# EAGLE design KNXTransceiverBoard_Aufsteck_V1 (EAGLE 6.1)
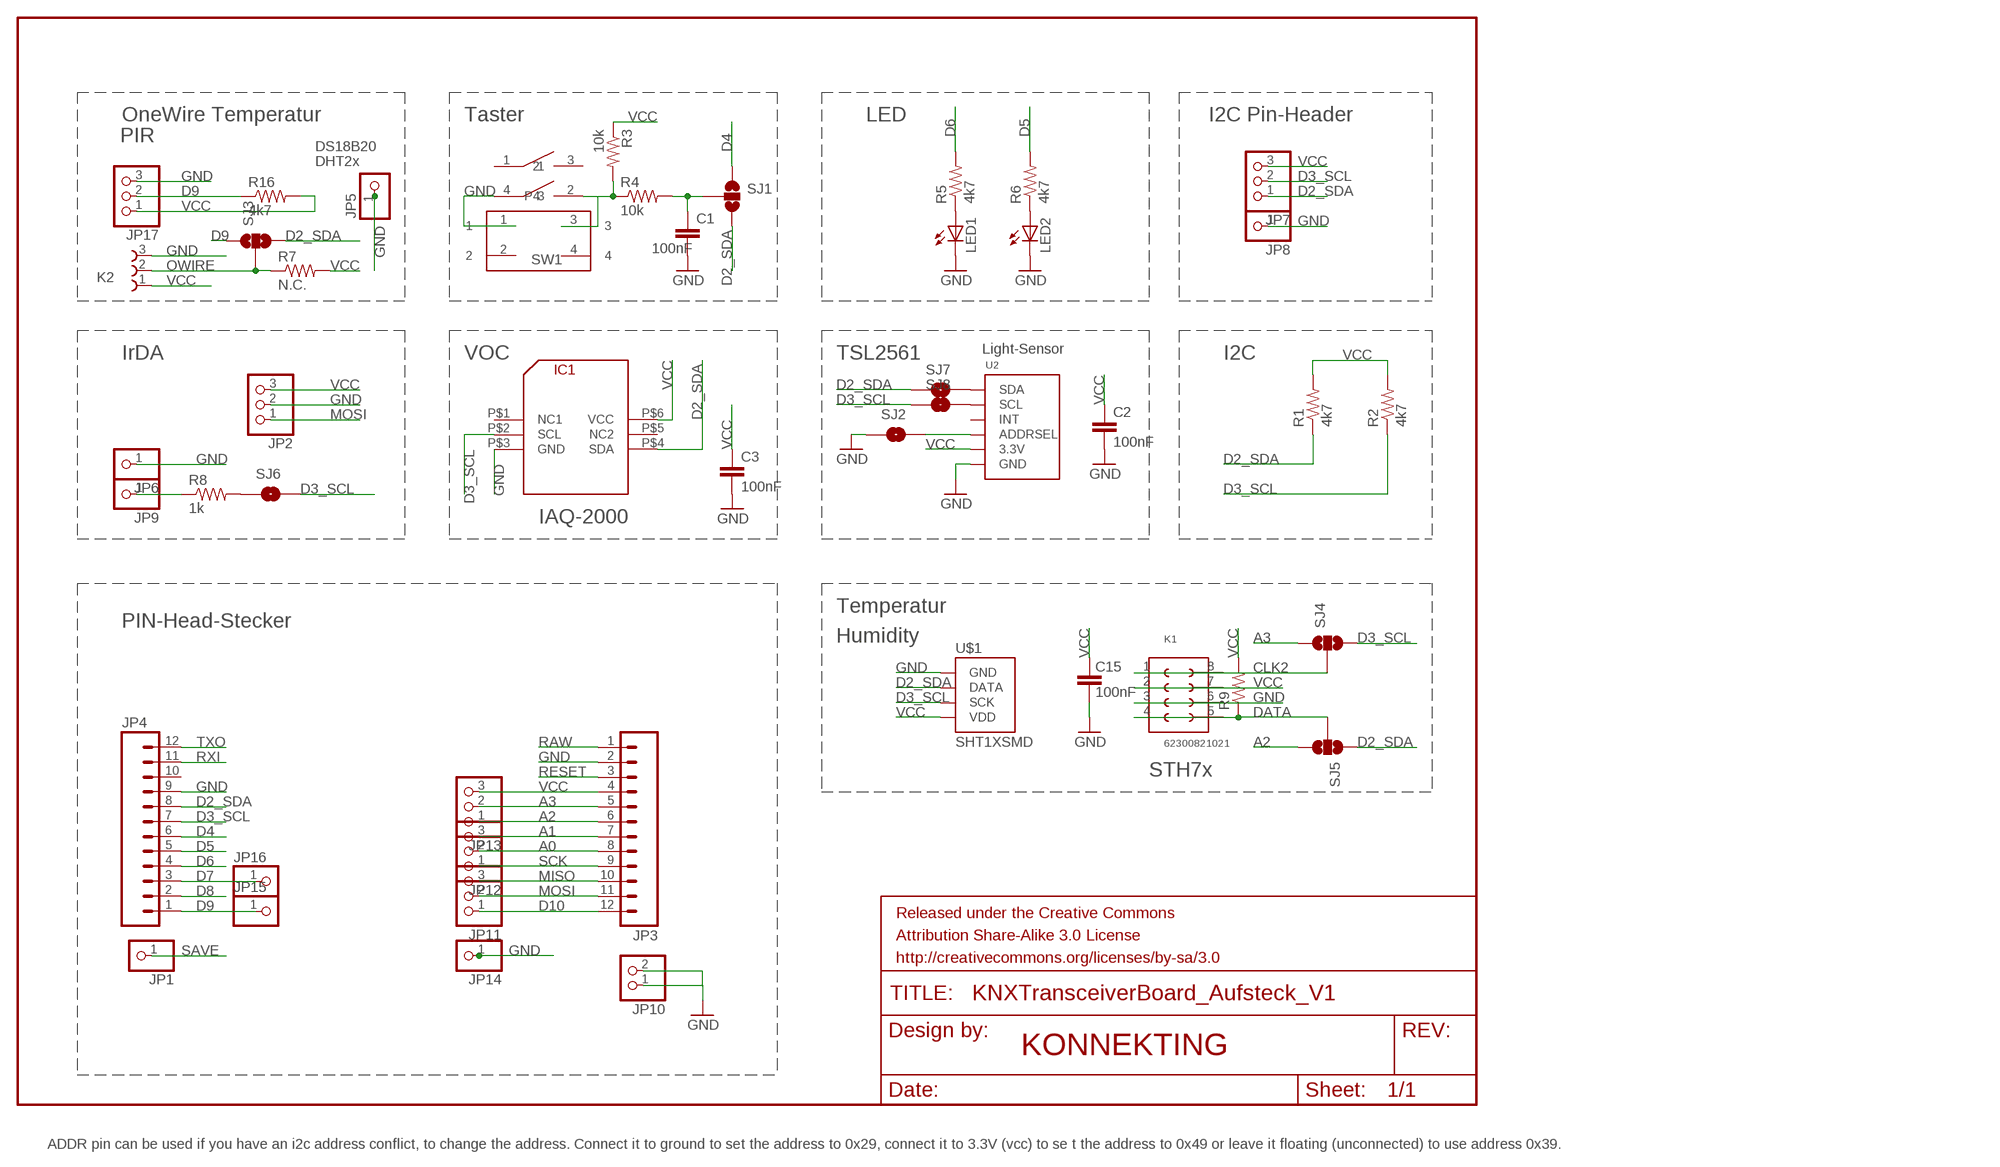
[diagram p0: schematic, sheet 1]

## Parts
C1  100nF  C-EUC0603  [C0603]
C2  100nF  C-EUC0603  [C0603]
C3  100nF  C-EUC0603  [C0603]
C15  100nF  CAP0603-CAP  [0603-CAP]
FRAME1  FRAME-LETTER  [CREATIVE_COMMONS]
IC1  AMSVOC  [AMSVOC]
JP1  PINHD-1X1  [1X01]
JP2  PINHD-1X3  [1X03]
JP3  M12PTH  [1X12]
JP4  M12PTH  [1X12]
JP5  PINHD-1X1  [1X01]
JP6  PINHD-1X1  [1X01]
JP7  PINHD-1X3  [1X03]
JP8  PINHD-1X1  [1X01]
JP9  PINHD-1X1  [1X01]
JP10  PINHD-1X2  [1X02]
JP11  PINHD-1X3  [1X03]
JP12  PINHD-1X3  [1X03]
JP13  PINHD-1X3  [1X03]
JP14  PINHD-1X1  [1X01]
JP15  PINHD-1X1  [1X01]
JP16  PINHD-1X1  [1X01]
JP17  PINHD-1X3  [1X03]
K1  62300821021  [62300821021]
K2  691101710003  [691101710003]
LED1  LEDCHIPLED_0805  [CHIPLED_0805]
LED2  LEDCHIPLED_0805  [CHIPLED_0805]
R1  4k7  RESISTOR0603-RES  [0603-RES]
R2  4k7  RESISTOR0603-RES  [0603-RES]
R3  10k  RESISTOR0603-RES  [0603-RES]
R4  10k  RESISTOR0603-RES  [0603-RES]
R5  4k7  RESISTOR0603-RES  [0603-RES]
R6  4k7  RESISTOR0603-RES  [0603-RES]
R7  N.C.  RESISTOR0603-RES  [0603-RES]
R8  1k  RESISTOR0603-RES  [0603-RES]
R9  RESISTOR0603-RES  [0603-RES]
R16  4k7  RESISTOR0603-RES  [0603-RES]
SJ1  SOLDERJUMPER_2WAY-OLDS  [SJ_3]
SJ2  SOLDERJUMPERNO  [SJ_2S-NO]
SJ3  SOLDERJUMPER_2WAY-OLDS  [SJ_3]
SJ4  SOLDERJUMPER_2WAY-OLDS  [SJ_3]
SJ5  SOLDERJUMPER_2WAY-OLDS  [SJ_3]
SJ6  SOLDERJUMPERNO  [SJ_2S-NO]
SJ7  SOLDERJUMPERNO  [SJ_2S-NO]
SJ8  SOLDERJUMPERNO  [SJ_2S-NO]
SW1  430156095926  [430156095926]
U2  TSL2561  [TSL2561_FN]
U$1  SHT1XSMD  [SHT1X]
U$2  TASTER  [TASTER]

## Nets
A0: JP3.8 JP12.2
A1: JP3.7 JP12.3
A2: JP3.6 JP13.1 SJ5.3
A3: JP3.5 JP13.2 SJ4.1
CLK2: K1.1 K1.8 SJ4.2
D2_SDA: IC1.P$4(SDA) JP4.8 JP7.1 R1.1 SJ1.3 SJ3.3 SJ5.1 SJ7.1 U$1.2(DATA)
D3_SCL: IC1.P$2(SCL) JP4.7 JP7.2 R2.1 SJ4.3 SJ6.2 SJ8.1 U$1.3(SCK)
D4: JP4.6 SJ1.1
D5: JP4.5 R6.2
D6: JP4.4 R5.2
D7: JP4.3 JP16.1
D8: JP4.2
D9: JP4.1 JP15.1 JP17.2 R16.1 SJ3.1
D10: JP3.12 JP11.1
DATA: K1.4 K1.5 R9.1 SJ5.2
GND [vcc]: C1.2 C2.2 C3.2 C15.1 IC1.P$3(GND) JP2.2 JP3.2 JP4.9 JP5.1 JP6.1 JP8.1 JP10.1 JP10.2 JP14.1 JP17.3 K1.3 K1.6 K2.3 LED1.C LED2.C SJ2.1 SW1.1 U2.VSS(GND) U$1.1(GND) U$2.4
MISO: JP3.10 JP11.3
MOSI: JP2.1 JP3.11 JP11.2
N$1: R3.2 R4.1 SW1.3 U$2.2(P4)
N$2: C1.1 R4.2 SJ1.2
N$3: LED1.A R5.1
N$4: LED2.A R6.1
N$5: JP9.1 R8.1
N$6: R8.2 SJ6.1
N$7: SJ7.2 U2.DATA(SDA)
N$8: SJ8.2 U2.CLK(SCL)
N$10: SJ2.2 U2.ADR(ADDRSEL)
OWIRE: K2.2 R7.1 SJ3.2
RAW [vcc]: JP3.1
RESET: JP3.3
RXI: JP4.11
SAVE: JP1.1
SCK: JP3.9 JP12.1
TXO: JP4.12
VCC: C2.1 C3.1 C15.2 IC1.P$6(VCC) JP2.3 JP3.4 JP7.3 JP13.3 JP17.1 K1.2 K1.7 K2.1 R1.2 R2.2 R3.1 R7.2 R9.2 R16.2 U2.VDD(3.3V) U$1.4(VDD)
Unconnected: IC1.P$1(NC1) IC1.P$5(NC2) JP4.10 SW1.2 SW1.4 U2.INT U$2.1 U$2.3

## Notes on the sheet
- OneWire Temperatur | Taster | LED | I2C Pin-Header
- PIR
- DS18B20
- DHT2x
- Light-Sensor
- IrDA | VOC | TSL2561 | I2C
- IAQ-2000
- Temperatur
- PIN-Head-Stecker
- Humidity
- STH7x
- KONNEKTING
- ADDR pin can be used if you have an i2c address conflict, to change the address. Connect it to ground to set the address to 0x29, connect it to 3.3V (vcc) to se t the address to 0x49 or leave it floating (unconnected) to use address 0x39.

## Library data of the parts
C1-C3 = rcl:C-EU: CAPACITOR, European symbol
C15 = SparkFun:CAP: Capacitor Standard 0603 ceramic capacitor, and 0.1" leaded capacitor.
FRAME1 = SparkFun-Aesthetics:FRAME-LETTER: Schematic Frame Standard 8.5x11 US Letter frame
IC1 = AMSVOC:AMSVOC
JP1 JP5 JP14-JP16 = pinhead:PINHD-1X1: PIN HEADER
JP2 JP7 JP11-JP13 JP17 = adafruit:PINHD-1X3: PIN HEADER
JP3 JP4 = SparkFun:M12: Header 12 Standard 12-pin 0.1" header. Use with straight break away headers (SKU : PRT-00116), right angle break away headers (PRT-00553), swiss pins (PRT-00743), machine pins (PRT-00117), and female headers (PRT-00115).
JP6 JP8 JP9 = adafruit:PINHD-1X1: Pin header 1x1 for 0.1" spacing With round pins
JP10 = pinhead:PINHD-1X2: PIN HEADER
K1 = Wuerth_Elektronik_eiCan_01_Pin__Socked_Headers_v1_3:62300821021: WR-PHD 1.27mm Dual SMT Socket Header H=4.50mm, 8 Pins
K2 = Wuerth_Elektronik_TerminalBlocks:691101710003: WR-TBL Serie 101 - 5.0mm HOrizontal Entry Modular with Pressure Clamp - 2.5mm2 Wires , 3 pins=>Code : Con-TBL_Screw_PressureClamp_691101710003 <http://katalog.we-online.de/media/images/eican/Con-TBL_Screw_PressureClamp_6911017100xx_pf2.jpg> Details see: http://katalog.we-online.de/en/em/691_101_710_0xx Created 2014-06-17, Karrer Zheng 2014 (C) Würth Elektronik
LED1 LED2 = led:LED: LED OSRAM: - CHIPLED LG R971, LG N971, LY N971, LG Q971, LY Q971, LO R971, LY R971 LH N974, LH R974 LS Q976, LO Q976, LY Q976 LO Q996 - Hyper CHIPLED LW Q18S LB Q993, LB Q99A, LB R99A - SideLED LS A670, LO A670, LY A670, LG A670, LP A670 LB A673, LV A673, LT A673, LW A673 LH A674 LY A675 LS A676, LA A676, LO A676, LY A676, LW A676 LS A679, LY A679, LG A679 - Hyper Micro SIDELED® LS Y876, LA Y876, LO Y876, LY Y876 LT Y87S - SmartLED LW L88C, LW L88S LB L89C, LB L89S, LG L890 LS L89K, LO L89K, LY L89K LS L896, LA L896, LO L896, LY L896 - TOPLED LS T670, LO T670, LY T670, LG T670, LP T670 LSG T670, LSP T670, LSY T670, LOP T670, LYG T670 LG T671, LOG T671, LSG T671 LB T673, LV T673, LT T673, LW T673 LH T674 LS T676, LA T676, LO T676, LY T676, LB T676, LH T676, LSB T676, LW T676 LB T67C, LV T67C, LT T67C, LS T67K, LO T67K, LY T67K, LW E67C LS E67B, LA E67B, LO E67B, LY E67B, LB E67C, LV E67C, LT E67C LW T67C LS T679, LY T679, LG T679 LS T770, LO T770, LY T770, LG T770, LP T770 LB T773, LV T773, LT T773, LW T773 LH T774 LS E675, LA E675, LY E675, LS T675 LS T776, LA T776, LO T776, LY T776, LB T776 LHGB T686 LT T68C, LB T68C - Hyper Mini TOPLED® LB M676 - Mini TOPLED Santana® LG M470 LS M47K, LO M47K, LY M47K Source: http://www.osram.convergy.de LUXEON: - LUMILED® LXK2-PW12-R00, LXK2-PW12-S00, LXK2-PW14-U00, LXK2-PW14-V00 LXK2-PM12-R00, LXK2-PM12-S00, LXK2-PM14-U00 LXK2-PE12-Q00, LXK2-PE12-R00, LXK2-PE12-S00, LXK2-PE14-T00, LXK2-PE14-U00 LXK2-PB12-K00, LXK2-PB12-L00, LXK2-PB12-M00, LXK2-PB14-N00, LXK2-PB14-P00, LXK2-PB14-Q00 LXK2-PR12-L00, LXK2-PR12-M00, LXK2-PR14-Q00, LXK2-PR14-R00 LXK2-PD12-Q00, LXK2-PD12-R00, LXK2-PD12-S00 LXK2-PH12-R00, LXK2-PH12-S00 LXK2-PL12-P00, LXK2-PL12-Q00, LXK2-PL12-R00 Source: www.luxeon.com KINGBRIGHT: KA-3528ASYC Source: www.kingbright.com
R1-R9 R16 = SparkFun:RESISTOR: Resistor Basic schematic elements and footprints for 0603, 1206, and PTH resistors.
SJ1 SJ3-SJ5 = SparkFun:SOLDERJUMPER_2WAY-OLD: Solder Jumper 2 way solder jumper
SJ2 SJ6-SJ8 = SparkFun:SOLDERJUMPER: Solder Jumper Standard SMD solder jumper. Used to automate production. Two varients : Normally Open and Normally Closed are the same, but have different paste layers. NC will have a large amount of paste and should jumper during reflow.
SW1 = Wuerth_Kurzhubtaster:430156095926: WS-TST-6x6 mm THT Tact Switch,4 pins
U2 = microbuilder:TSL2561: TSL2561 Light-To-Digital Sensor Mouser Part Numbers: CS (obsolete): 856-TSL2561CS DFN (cheapest): 856-TSL2561FN
U$1 = SparkFun:SHT1X: SHT1x Humdity Sensor Sensirion humdity sensor. Schematic element and footprint proven. Spark Fun Electronics SKU : COM-08227
U$2 = Matthias_1:TASTER

## Net classes
0 default: width 0.203 mm
1 vcc: width 0.254 mm

## Board
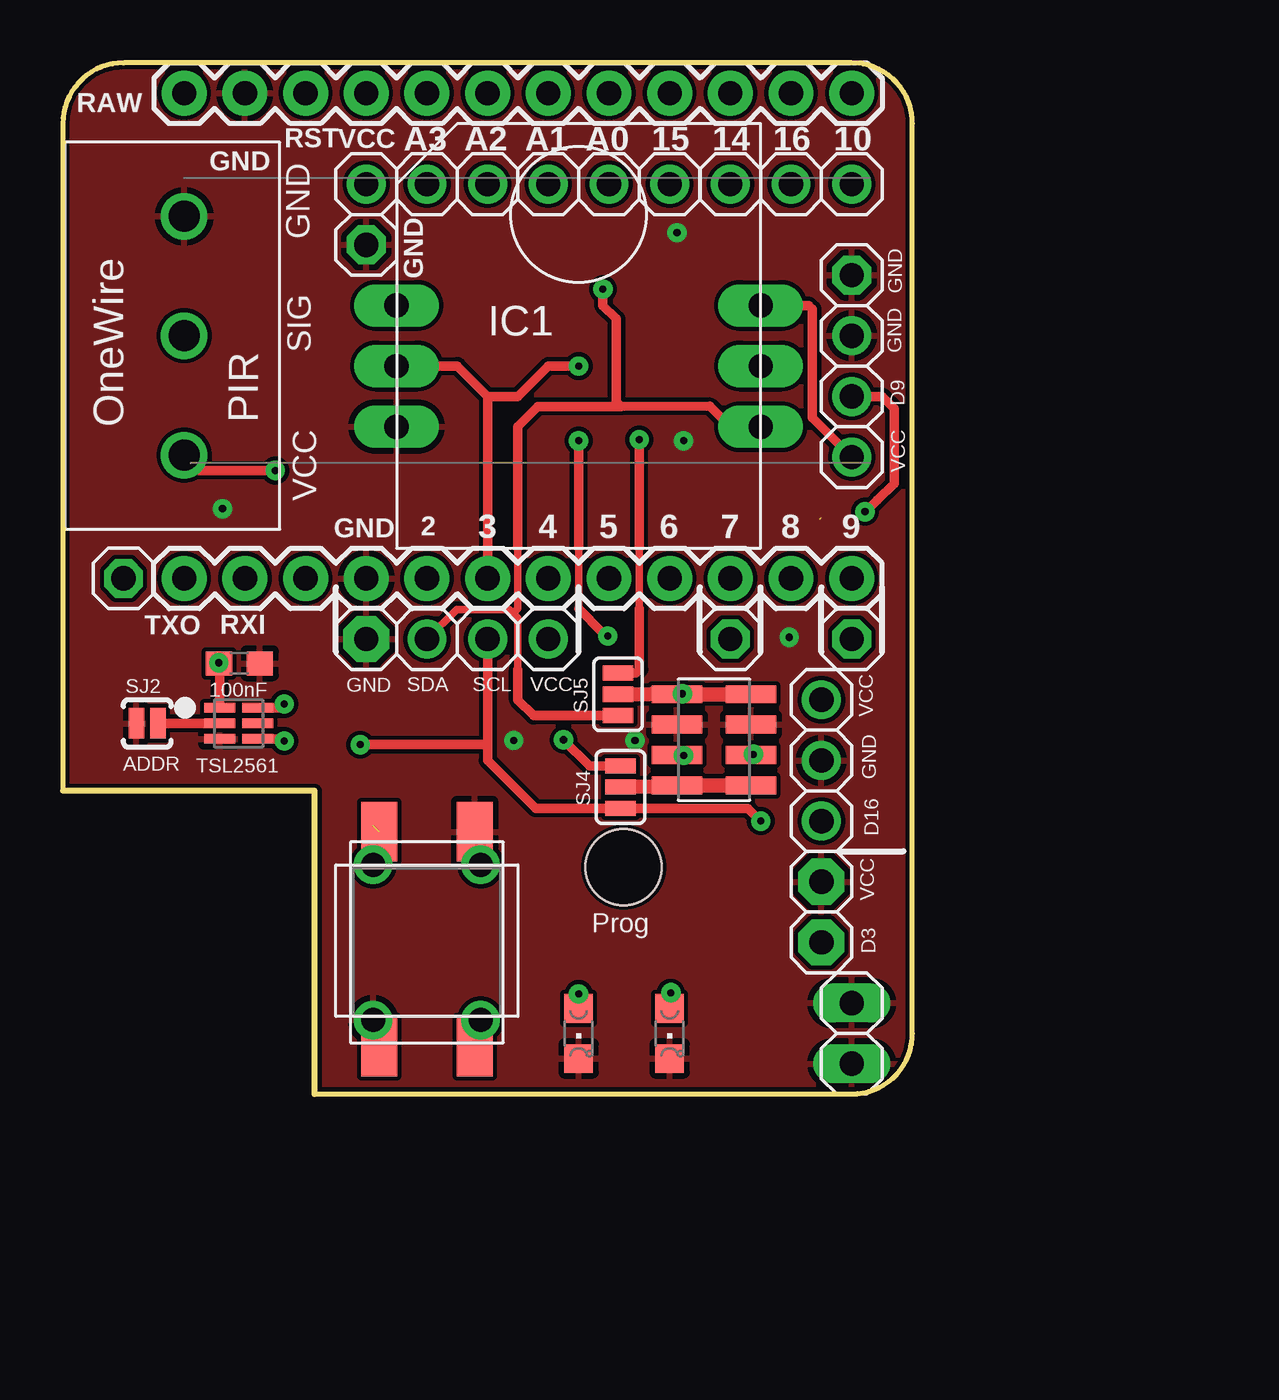
[diagram p1: board, top side]
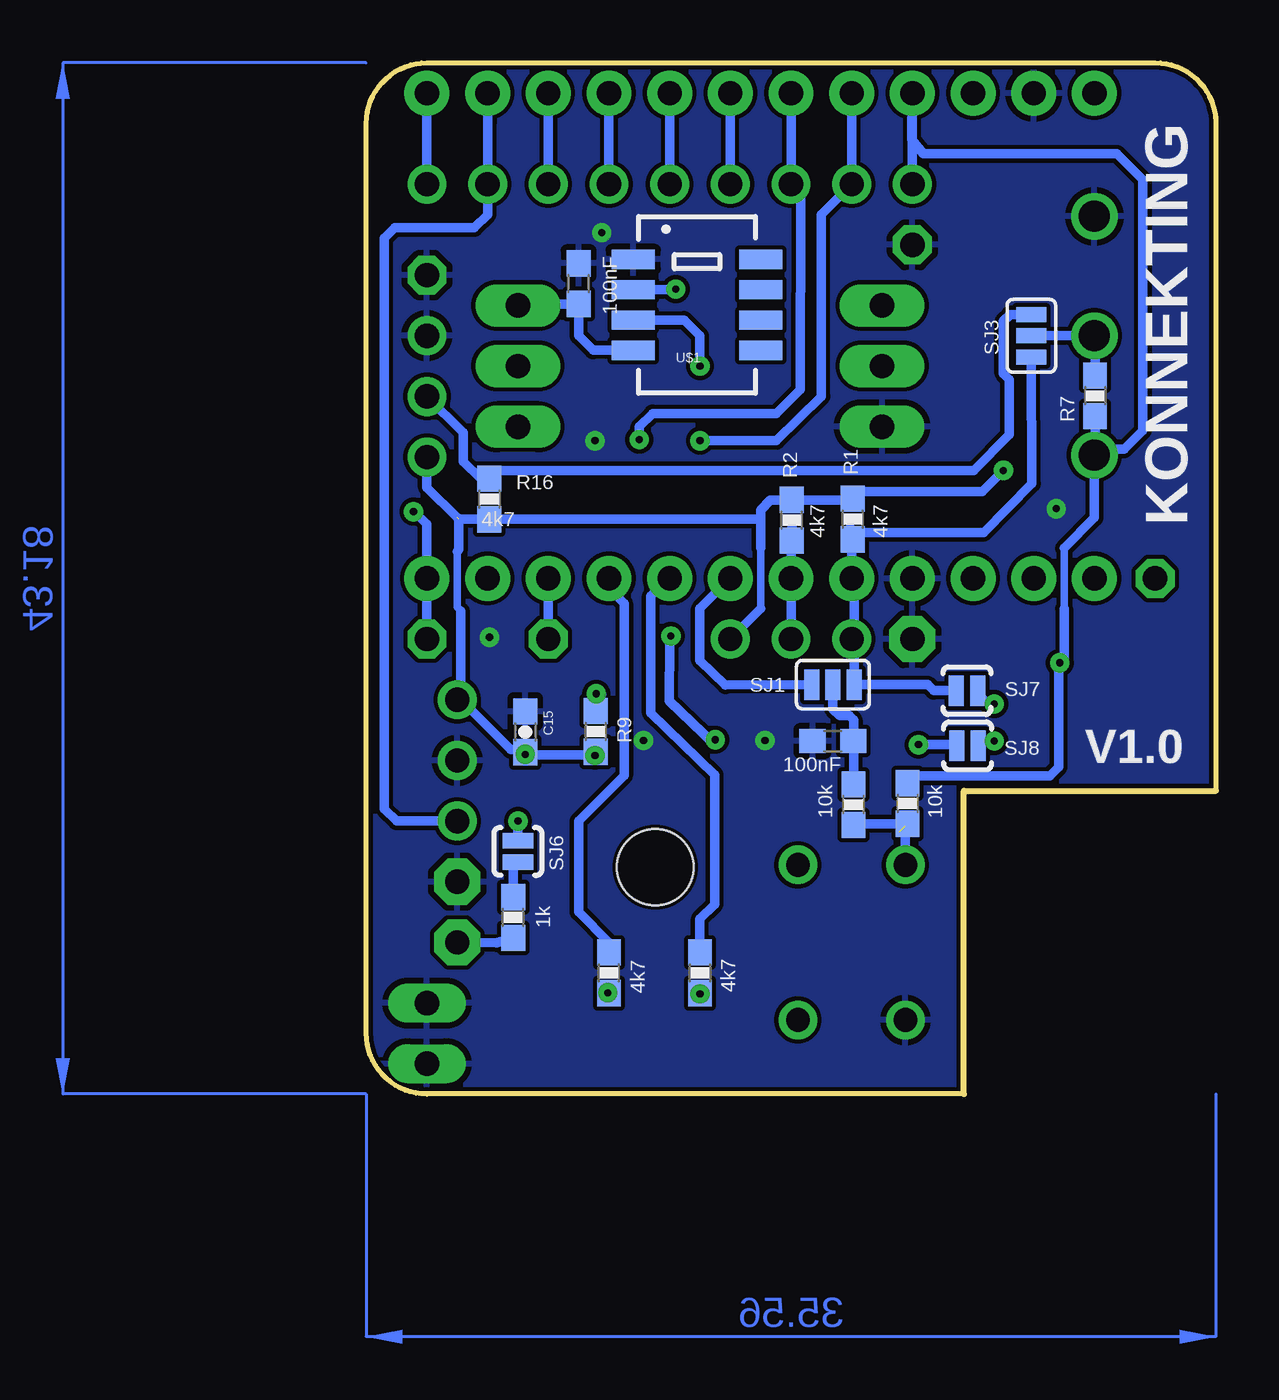
[diagram p2: board, bottom side, seen from below]

Size 35.56 x 43.18 mm. Coordinates in mm from the lower left corner, seen from the top.
Outline: 10.54,0 33.02,0 arc90 35.56,2.54 35.56,40.64 arc90 33.02,43.18 2.54,43.18 arc90 0,40.64 0,12.7 10.54,12.7 10.54,0
Copper layers (1*16): Top 0.035mm / dielectric 1.5mm / Bottom 0.035mm
Design rules: minimum track width 8mil, minimum drill 15mil, track to track 7mil, track to pad 7mil, pad to pad 7mil, via to via 7mil, smd to smd 7mil, copper to edge 7mil, drill to drill 7mil, minimum pad ring 12mil, minimum via ring 10mil, stop-mask expansion 4mil, vias tented up to drill 20mil, thermal gap 10mil
Holes 3.2 mm at 23.47,9.5
tRestrict: area -21.3,-1.8 to -21.1,-1.7; area -17.4,2.2 to -17.3,2.2; area -25,-1.2 to -17.9,6.1

### Footprints (pad centres in the part's own frame; a part is rotated, then mirrored left to right if it is on the bottom)
C0603 = smd 1.1 x 1: 1 -0.85,0; 2 0.85,0
0603-CAP = smd 1.1 x 1: 1 -0.85,0; 2 0.85,0
AMSVOC = drill 1.016 pad 1.778 long: P$1 0,10.16; P$2 0,7.62; P$3 0,5.08; P$4 15.24,5.08; P$5 15.24,7.62; P$6 15.24,10.16
1X01 = drill 1.016 octagon: 1 0,0
1X03 = drill 1.016: 1 -2.54,0; 2 0,0; 3 2.54,0
1X12 = drill 1.016 pad 1.88: 1 0,0; 2 2.54,0; 3 5.08,0; 4 7.62,0; 5 10.16,0; 6 12.7,0; 7 15.24,0; 8 17.78,0; 9 20.32,0; 10 22.86,0; 11 25.4,0; 12 27.94,0
1X01' = drill 1.016 pad 1.93 octagon: 1 0,0
1X02 = drill 1.016 long: 1 -1.27,0; 2 1.27,0
62300821021 = smd 0.75 x 2.1: 1 -1.905,1.55; 2 -0.635,1.55; 3 0.635,1.55; 4 1.905,1.55; 5 1.905,-1.55; 6 0.635,-1.55; 7 -0.635,-1.55; 8 -1.905,-1.55
691101710003 = drill 1.3: 1 -5,0; 2 0,0; 3 5,0
CHIPLED_0805 = smd 1.2 x 1.2: A 0,-1.05; C 0,1.05
0603-RES = smd 1.1 x 1: 1 -0.85,0; 2 0.85,0
SJ_3 = smd 0.635 x 1.27: 1 -0.889,0; 2 0,0; 3 0.889,0
SJ_2S-NO = smd 0.635 x 1.27: 1 -0.45,0; 2 0.45,0
430156095926 = drill 1: 1 -3.25,2.25; 2 -3.25,-2.25; 3 3.25,2.25; 4 3.25,-2.25
TSL2561_FN = smd 1.3 x 0.4: ADR -0.8,0; CLK 0.8,-0.65; DATA 0.8,0.65; INT 0.8,0; VDD -0.8,0.65; VSS -0.8,-0.65
SHT1X = smd 1.8 x 0.8: 1 -2.667,1.905; 2 -2.667,0.635; 3 -2.667,-0.635; 4 -2.667,-1.905; 5 2.667,-1.905; 6 2.667,-0.635; 7 2.667,0.635; 8 2.667,1.905
TASTER = smd 1.5 x 2.5: 1 -2,0; 2 -2,9; 3 2,0; 4 2,9

### Placement (x,y rotation side)
C1  16.03,14.78 180 bottom
C2  7.39,18.03 0 top
C3  26.67,33.93 90 bottom
C15  28.91,15.16 270 bottom
FRAME1  29.79,16.63 90 top
IC1  13.97,22.86 0 top
JP1  2.54,21.59 0 top
JP2  31.75,13.97 90 top
JP3  5.08,41.91 0 top
JP4  33.02,21.59 180 top
JP5  33.02,34.29 0 top
JP6  [1X01']  31.75,8.89 0 top
JP7  17.78,19.05 0 top
JP8  [1X01']  12.7,19.05 0 top
JP9  [1X01']  31.75,6.35 0 top
JP10  33.02,2.54 90 top
JP11  30.48,38.1 180 top
JP12  22.86,38.1 180 top
JP13  15.24,38.1 180 top
JP14  12.7,35.56 0 top
JP15  33.02,19.05 0 top
JP16  27.94,19.05 0 top
JP17  33.02,29.21 90 top
K1  27.25,14.83 90 top
K2  5.08,31.75 90 top
LED1  25.4,2.54 180 top
LED2  21.59,2.54 180 top
R1  15.19,24.08 90 bottom
R2  17.75,24.03 90 bottom
R3  12.9,12.17 270 bottom
R4  15.16,12.12 90 bottom
R5  25.4,5.08 90 bottom
R6  21.59,5.08 90 bottom
R7  5.05,29.24 270 bottom
R8  29.41,7.39 90 bottom
R9  25.96,15.19 270 bottom
R16  30.4,24.92 270 bottom
SJ1  16.03,17.14 0 bottom
SJ2  3.53,15.52 0 top
SJ3  7.72,31.75 270 bottom
SJ4  23.34,12.85 270 top
SJ5  23.24,16.74 90 top
SJ6  29.21,10.16 90 bottom
SJ7  10.41,16.89 0 bottom
SJ8  10.39,14.58 0 bottom
SW1  15.24,6.35 90 top
U2  7.37,15.52 0 top
U$1  21.72,33.05 0 bottom
U$2  15.24,1.98 0 top

### Tracks (layer width: path | path; a pad name or v marks a point on that pad's centre or on a via)
A0
  Bottom 0.406: JP3.8 JP12.2
A1
  Bottom 0.406: JP12.3 JP3.7
A2  (via drill 0.3)
  Top 0.305: 24.13,20.32 24.13,22.86
  Top 0.406: SJ5.3 23.98,17.63 24.13,17.78 24.13,20.32 | 24.13,22.86 v24.13,27.41
  Bottom 0.406: JP3.6 JP13.1 17.78,38.05 17.37,37.64 17.4,29.49 18.39,28.5 23.57,28.5 24.13,27.94 v24.13,27.41
A3  (via drill 0.3)
  Top 0.305: 21.59,20.32 21.59,22.86
  Top 0.406: SJ4.1 22.05,13.74 v20.96,14.83 | v22.81,19.18 22.58,19.33 21.59,20.32 | 21.59,22.86 v21.59,27.36
  Bottom 0.406: JP3.5 JP13.2 16.51,36.83 16.51,29.21 18.39,27.36 v21.59,27.36 | v20.96,14.83 20.98,14.63 22.89,16.46 22.86,18.92 v22.81,19.18
CLK2
  Top 0.61: K1.8 25.73,12.93 | 25.73,12.93 25.68,12.88 25.65,12.88 | SJ4.2 25.65,12.88 | 25.65,12.88 25.68,12.9 | 25.73,12.93 K1.1
D2_SDA  (via drill 0.3)
  Top 0.305: 19.05,17.78 19.05,19.94 18.86,20.13 | 18.86,20.13 18.69,20.3 16.49,20.3 JP7.1 | 19.05,22.86 19.05,20.32 18.86,20.13
  Top 0.406: SJ5.1 19.71,15.85 19.05,16.51 19.05,17.78 | IC1.P$4 27.94,27.94 27.08,28.8 23.37,28.79 | 23.37,28.79 19.89,28.78 19.05,27.94 19.05,22.86 | v22.61,33.71 22.61,33.02 23.17,32.46 23.17,28.99 23.37,28.79
  Bottom 0.406: SJ1.3 15.14,21.49 JP4.8 15.24,23.57 | 15.24,23.57 R1.1 | R1.1 15.04,23.47 15,23.51 9.71,23.51 7.7,25.55 SJ3.3 | SJ1.3 15.14,18.95 JP7.1 | 15.29,23.62 15.29,23.7 15.26,23.49 | 15.26,23.49 15.29,23.72 15.24,23.57 | R1.1 15.26,23.49 | SJ1.3 12.07,17.14 11.81,16.89 SJ7.1 | U$1.2 22.63,33.68 v22.61,33.71
D3_SCL  (via drill 0.3)
  Top 0.406: v29.21,11.43 28.68,11.96 SJ4.3 19.79,11.96 17.78,13.97 17.78,14.5 | JP7.2 17.78,14.5 | v12.45,14.63 17.65,14.63 17.78,14.5 | IC1.P$2 16.51,30.48 17.78,29.21 | 17.78,29.21 JP4.7 | v21.59,30.48 20.32,30.48 19.05,29.21 17.78,29.21
  Bottom 0.406: 17.78,23.49 JP4.7 JP7.2 | 17.73,23.72 17.75,23.65 17.78,23.49 | R2.1 17.78,23.49 | v29.21,11.43 SJ6.2 29.21,10.59 | v12.45,14.63 10.92,14.63 10.87,14.58 SJ8.1 | U$1.3 22.25,32.41 21.59,31.75 v21.59,30.48
D4
  Bottom 0.406: SJ1.1 20.52,17.12 21.59,18.16 21.59,20.32 JP4.6
D5
  Bottom 0.406: R6.2 21.59,7.34 20.98,7.95 20.98,13.36 23.65,15.95 23.65,20.85 22.94,21.59 JP4.5
D6
  Bottom 0.406: R5.2 25.4,6.35 26.67,7.62 26.67,11.43 24.76,13.34 24.76,20.55 25.4,21.18 JP4.4
D7
  Bottom 0.406: JP4.3 JP16.1
D9  (via drill 0.3)
  Top 0.406: v33.58,24.38 34.09,24.87 34.8,25.55 34.8,28.7 34.29,29.21 JP17.2
  Bottom 0.406: SJ3.1 8.61,32.64 8.89,32.36 8.89,30.17 8.64,29.92 8.64,27.61 10.14,26.11 30.06,26.11 R16.1 30.77,25.77 31.5,26.49 31.5,27.69 JP17.2 | JP15.1 JP4.1 33.02,23.88 v33.58,24.38
D10
  Bottom 0.406: JP3.12 JP11.1
DATA  (via drill 0.3)
  Top 0.61: K1.5 K1.4 v25.93,16.76 SJ5.2
  Bottom 0.406: R9.1 25.96,16.48 K1.4 v25.93,16.76
GND  (via drill 0.3)
  other vias: 23.95,14.81 18.87,14.81 30.4,19.13 25.98,27.36 25.7,36.07 6.68,24.51
  pour Top: 0,40.64 0,2.54 arc99 2.54,0 33.02,0 arc97 35.56,2.54 35.56,40.64 arc90 33.02,43.18 2.54,43.18 arc90
  pour Bottom: 0,40.64 0,2.54 arc99 2.54,0 33.02,0 arc97 35.56,2.54 35.56,40.64 arc90 33.02,43.18 2.54,43.18 arc90
MISO
  Bottom 0.406: JP3.10 JP11.3
MOSI
  Bottom 0.406: 30.48,40.64 JP3.11 JP11.2 30.48,36.83 31.04,36.27 34.37,36.27 34.8,35.84 34.8,11.94 34.29,11.43 JP2.1
N$1  (1 unrouted)
  Top 0.406: U$2.2 13.24,10.41 12.99,10.16
  Bottom 0.406: R4.1 15.11,11.32 R3.2 12.99,11.23 SW1.3
N$2
  Bottom 0.406: SJ1.2 16.03,16.13 15.75,15.85 15.34,15.85 15.16,15.67 15.16,14.8 C1.1 15.16,14.77 R4.2
N$3  (via drill 0.3)
  Top 0.406: LED1.A 25.49,3.59 v25.45,4.24
  Bottom 0.406: v25.45,4.24 25.54,4.09 R5.1
N$4  (via drill 0.3)
  Top 0.406: LED2.A v21.59,4.19
  Bottom 0.406: v21.59,4.19 21.65,4.17 R6.1
N$5
  Bottom 0.406: JP9.1 30.11,6.32 R8.1
N$6
  Bottom 0.406: R8.2 29.41,9.51 SJ6.1
N$7  (via drill 0.3)
  Top 0.406: U2.DATA 9.08,16.17 v9.27,16.33
  Bottom 0.406: v9.27,16.33 9.68,16.43 9.86,16.71 | 9.86,16.71 9.96,16.87 | SJ7.2 9.96,16.82 9.86,16.71
N$8  (via drill 0.3)
  Top 0.406: U2.CLK 9.18,14.87 v9.27,14.78
  Bottom 0.406: v9.27,14.78 9.73,14.78 9.96,14.55 9.96,14.56 SJ8.2
N$10
  Top 0.406: U2.ADR SJ2.2
OWIRE
  Bottom 0.406: R7.1 5.05,31.73 K2.2 SJ3.2
SCK
  Bottom 0.406: JP3.9 JP12.1
VCC  (via drill 0.3)  (1 unrouted)
  Top 0.406: U2.VDD 6.57,18.01 C2.1 6.55,18.05 v6.53,18.06 | v8.89,26.11 5.72,26.11 K2.1 | IC1.P$6 31.22,33.02 31.37,32.87 31.37,28.32 JP17.1 | v28.9,14.22 28.86,14.25 K1.7 | v25.98,14.17 26.03,14.2 K1.2
  Bottom 0.305: 6.35,22.86 6.35,20.32 | 19.05,20.32 19.05,22.86 | 31.75,22.71 31.75,20.4 31.6,20.22
  Bottom 0.406: R3.1 12.9,13.06 12.65,13.31 6.96,13.31 6.58,13.69 6.58,17.98 | 6.58,17.98 v6.53,18.06 | R7.2 5.05,26.77 K2.1 | K2.1 5.08,24.13 6.35,22.86 | 6.35,20.32 6.35,18.21 6.58,17.98 | v8.89,26.11 9.78,25.22 14.9,25.22 R1.2 15.13,24.87 15.04,24.87 15.04,24.84 15.07,24.88 R2.2 17.77,24.87 18.64,24.87 19.05,24.46 19.05,24.13 | K2.1 4.83,27 3.83,27 3.05,27.79 3.05,38.28 4.14,39.37 12.24,39.37 12.72,39.95 JP3.4 JP13.3 | JP7.3 19.05,20.32 | 19.05,22.86 19.05,24.13 | JP17.1 33.02,25.4 31.75,24.13 | 19.05,24.13 19.11,24.07 R16.2 31.69,24.07 31.69,22.8 31.75,22.71 | 31.6,20.22 31.6,16.66 JP2.3 31.55,16.46 29.51,14.43 29.01,14.43 28.87,14.24 C15.2 28.93,14.31 v28.9,14.22 28.83,14.22 K1.7 26.1,14.2 R9.2 26,14.45 v25.98,14.17 | IC1.P$6 29.15,33.08 C3.1 26.67,31.75 26.06,31.14 U$1.4
(copper drawn outside any net)
  shapes: Bottom area x2

### Text on the board
tPlace: RAW | RST | VCC | A3 | A2 | A1 | A0 | 15 | 14 | 16 | 10 | GND | GND | GND | 2 | 3 | 4 | 5 | 6 | 7 | 8 | 9 | TXO | RXI
bPlace: KONNEKTING | V1.0
tNames: GND | GND | SIG | GND | PIR | D9 | OneWire | VCC | VCC | GND | SDA | SCL | VCC | VCC | ADDR | TSL2561 | GND | D16 | VCC | Prog | D3
tDocu: N. Seidle, revised by P. Lewis